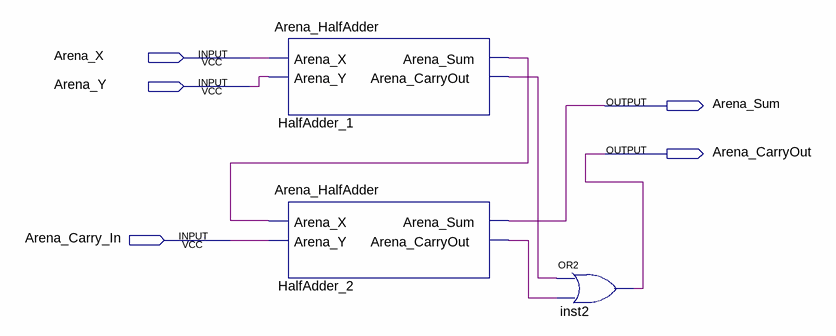
[diagram p0: schematic sheet]
// Quartus schematic Arena_FullAdder.bdf as structural Verilog: 3 symbols, 5 pins
module Arena_FullAdder (
  input  Arena_X,
  input  Arena_Y,
  input  Arena_Carry_In,
  output Arena_Sum,
  output Arena_CarryOut
);

  wire HalfAdder_1_arena_carryout, HalfAdder_1_arena_sum, HalfAdder_2_arena_carryout;

  Arena_HalfAdder HalfAdder_1 (
    .Arena_X(Arena_X), .Arena_Y(Arena_Y), .Arena_Sum(HalfAdder_1_arena_sum),
    .Arena_CarryOut(HalfAdder_1_arena_carryout));
  Arena_HalfAdder HalfAdder_2 (
    .Arena_X(HalfAdder_1_arena_sum), .Arena_Y(Arena_Carry_In), .Arena_Sum(Arena_Sum),
    .Arena_CarryOut(HalfAdder_2_arena_carryout));
  or inst2 (Arena_CarryOut, HalfAdder_1_arena_carryout, HalfAdder_2_arena_carryout);
endmodule
